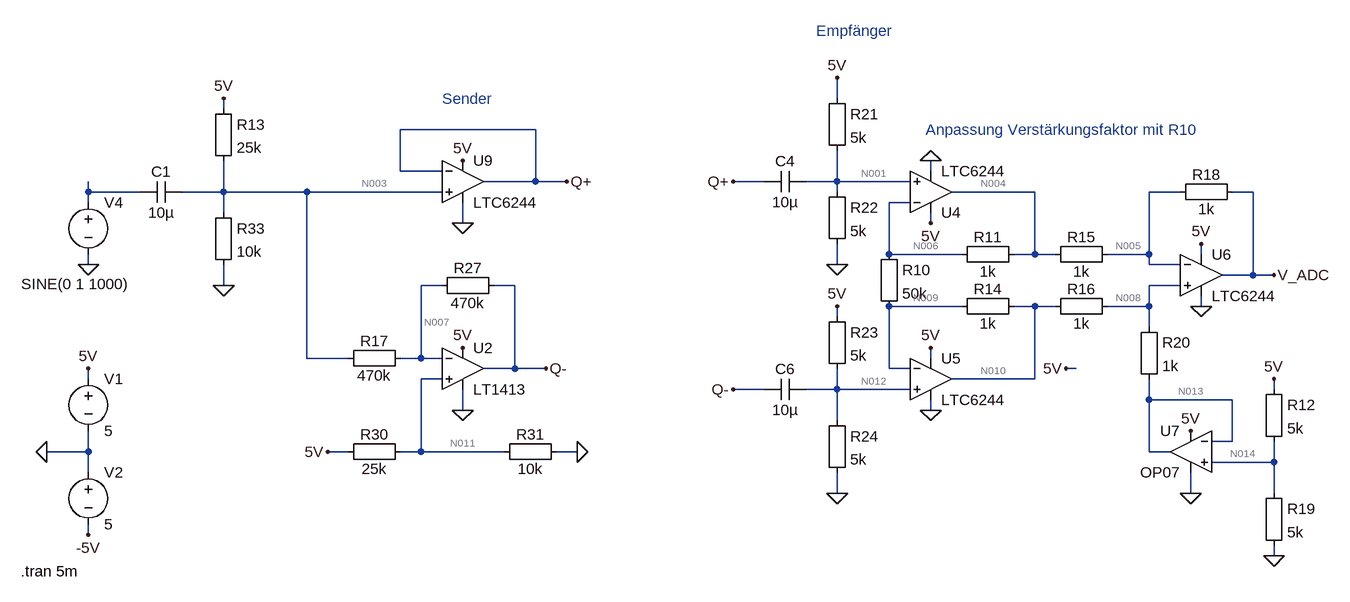
[diagram p0: schematic Schaltung und Anpassung.asc]
Schaltung und Anpassung.asc, the LTspice schematic file:
Version 4
SHEET 1 2416 1684
WIRE 1552 -80 1552 -112
WIRE 608 -64 608 -80
WIRE 1088 -32 880 -32
WIRE 880 32 880 -32
WIRE 944 32 880 32
WIRE 1696 32 1696 16
WIRE 1088 48 1088 -32
WIRE 1088 48 1008 48
WIRE 1136 48 1088 48
WIRE 1440 48 1392 48
WIRE 1552 48 1552 0
WIRE 1552 48 1504 48
WIRE 1664 48 1552 48
WIRE 400 64 400 48
WIRE 480 64 400 64
WIRE 608 64 608 16
WIRE 608 64 544 64
WIRE 736 64 608 64
WIRE 944 64 736 64
WIRE 1552 64 1552 48
WIRE 1856 64 1728 64
WIRE 2080 64 2032 64
WIRE 2192 64 2160 64
WIRE 400 80 400 64
WIRE 1664 80 1632 80
WIRE 608 96 608 64
WIRE 976 112 976 80
WIRE 1696 112 1696 96
WIRE 1632 160 1632 80
WIRE 1744 160 1632 160
WIRE 1856 160 1856 64
WIRE 1856 160 1824 160
WIRE 1888 160 1856 160
WIRE 2032 160 2032 64
WIRE 2032 160 1968 160
WIRE 2112 160 2112 144
WIRE 400 176 400 160
WIRE 1552 176 1552 144
WIRE 2032 176 2032 160
WIRE 2080 176 2032 176
WIRE 2192 192 2192 64
WIRE 2192 192 2144 192
WIRE 2224 192 2192 192
WIRE 608 208 608 176
WIRE 944 208 912 208
WIRE 1056 208 1024 208
WIRE 2080 208 2032 208
WIRE 1744 240 1632 240
WIRE 1856 240 1824 240
WIRE 1888 240 1856 240
WIRE 2032 240 2032 208
WIRE 2032 240 1968 240
WIRE 2112 240 2112 224
WIRE 1552 256 1552 240
WIRE 2032 272 2032 240
WIRE 736 320 736 64
WIRE 800 320 736 320
WIRE 912 320 912 208
WIRE 912 320 880 320
WIRE 944 320 912 320
WIRE 1696 320 1696 304
WIRE 1056 336 1056 208
WIRE 1056 336 1008 336
WIRE 1104 336 1056 336
WIRE 1632 336 1632 240
WIRE 1664 336 1632 336
WIRE 1920 336 1904 336
WIRE 400 352 400 336
WIRE 944 352 912 352
WIRE 1856 352 1856 240
WIRE 1856 352 1728 352
WIRE 1440 368 1392 368
WIRE 1552 368 1552 336
WIRE 1552 368 1504 368
WIRE 1664 368 1552 368
WIRE 2224 368 2224 352
WIRE 2032 384 2032 352
WIRE 2160 384 2032 384
WIRE 976 400 976 368
WIRE 1696 400 1696 384
WIRE 1552 416 1552 368
WIRE 2160 448 2160 384
WIRE 2160 448 2128 448
WIRE 400 464 400 432
WIRE 400 464 336 464
WIRE 800 464 768 464
WIRE 912 464 912 352
WIRE 912 464 880 464
WIRE 1040 464 912 464
WIRE 1152 464 1120 464
WIRE 2032 464 2032 384
WIRE 2064 464 2032 464
WIRE 2224 480 2224 448
WIRE 2224 480 2128 480
WIRE 400 496 400 464
WIRE 1552 528 1552 496
WIRE 2096 528 2096 496
WIRE 2224 528 2224 480
WIRE 400 592 400 576
WIRE 2224 624 2224 608
FLAG 1696 112 5V
FLAG 1696 304 5V
FLAG 2112 144 5V
FLAG 1696 16 0
FLAG 1696 400 0
FLAG 2112 240 0
FLAG 1552 176 0
FLAG 1552 528 0
FLAG 1552 -112 5V
FLAG 1552 240 5V
FLAG 1904 336 5V
FLAG 2224 192 V_ADC
FLAG 400 176 0
FLAG 976 16 5V
FLAG 976 304 5V
FLAG 976 112 0
FLAG 976 400 0
FLAG 1152 464 0
FLAG 768 464 5V
FLAG 608 208 0
FLAG 608 -80 5V
FLAG 1136 48 Q+
FLAG 1104 336 Q-
FLAG 1392 48 Q+
FLAG 1392 368 Q-
FLAG 2096 528 0
FLAG 2096 432 5V
FLAG 2224 624 0
FLAG 2224 352 5V
FLAG 336 464 0
FLAG 400 336 5V
FLAG 400 592 -5V
SYMBOL OpAmps\\LTC6244 1696 64 M180
SYMATTR InstName U4
SYMBOL OpAmps\\LTC6244 1696 352 R0
SYMATTR InstName U5
SYMBOL Misc\\EuropeanResistor 1616 144 R0
SYMATTR InstName R10
SYMATTR Value 50k
SYMBOL Misc\\EuropeanResistor 1840 144 R90
WINDOW 0 5 56 VBottom 2
WINDOW 3 27 56 VTop 2
SYMATTR InstName R11
SYMATTR Value 1k
SYMBOL Misc\\EuropeanResistor 1840 224 R90
WINDOW 0 5 56 VBottom 2
WINDOW 3 27 56 VTop 2
SYMATTR InstName R14
SYMATTR Value 1k
SYMBOL Misc\\EuropeanResistor 1984 144 R90
WINDOW 0 5 56 VBottom 2
WINDOW 3 27 56 VTop 2
SYMATTR InstName R15
SYMATTR Value 1k
SYMBOL Misc\\EuropeanResistor 1984 224 R90
WINDOW 0 5 56 VBottom 2
WINDOW 3 27 56 VTop 2
SYMATTR InstName R16
SYMATTR Value 1k
SYMBOL OpAmps\\LTC6244 2112 192 R0
SYMATTR InstName U6
SYMBOL Misc\\EuropeanResistor 2176 48 R90
WINDOW 0 5 56 VBottom 2
WINDOW 3 27 56 VTop 2
SYMATTR InstName R18
SYMATTR Value 1k
SYMBOL Misc\\EuropeanCap 1504 32 R90
WINDOW 0 0 32 VBottom 2
WINDOW 3 32 32 VTop 2
SYMATTR InstName C4
SYMATTR Value 10µ
SYMBOL Misc\\EuropeanCap 1504 352 R90
WINDOW 0 0 32 VBottom 2
WINDOW 3 32 32 VTop 2
SYMATTR InstName C6
SYMATTR Value 10µ
SYMBOL Misc\\EuropeanResistor 1536 -96 R0
SYMATTR InstName R21
SYMATTR Value 5k
SYMBOL Misc\\EuropeanResistor 1536 48 R0
SYMATTR InstName R22
SYMATTR Value 5k
SYMBOL Misc\\EuropeanResistor 1536 240 R0
SYMATTR InstName R23
SYMATTR Value 5k
SYMBOL Misc\\EuropeanResistor 1536 400 R0
SYMATTR InstName R24
SYMATTR Value 5k
SYMBOL voltage 400 64 R0
WINDOW 3 -103 142 Left 2
WINDOW 123 0 0 Left 0
WINDOW 39 0 0 Left 0
SYMATTR Value SINE(0 1 1000)
SYMATTR InstName V4
SYMBOL Misc\\EuropeanResistor 896 304 R90
WINDOW 0 5 56 VBottom 2
WINDOW 3 27 56 VTop 2
SYMATTR InstName R17
SYMATTR Value 470k
SYMBOL Misc\\EuropeanResistor 1040 192 R90
WINDOW 0 5 56 VBottom 2
WINDOW 3 27 56 VTop 2
SYMATTR InstName R27
SYMATTR Value 470k
SYMBOL Misc\\EuropeanResistor 896 448 R90
WINDOW 0 5 56 VBottom 2
WINDOW 3 27 56 VTop 2
SYMATTR InstName R30
SYMATTR Value 25k
SYMBOL Misc\\EuropeanResistor 1136 448 R90
WINDOW 0 5 56 VBottom 2
WINDOW 3 27 56 VTop 2
SYMATTR InstName R31
SYMATTR Value 10k
SYMBOL OpAmps\\LT1413 976 272 R0
SYMATTR InstName U2
SYMBOL OpAmps\\LTC6244 976 48 R0
SYMATTR InstName U9
SYMBOL cap 544 48 R90
WINDOW 0 0 32 VBottom 2
WINDOW 3 32 32 VTop 2
SYMATTR InstName C1
SYMATTR Value 10µ
SYMBOL Misc\\EuropeanResistor 592 -80 R0
SYMATTR InstName R13
SYMATTR Value 25k
SYMBOL Misc\\EuropeanResistor 592 80 R0
SYMATTR InstName R33
SYMATTR Value 10k
SYMBOL OpAmps\\OP07 2096 400 M0
SYMATTR InstName U7
SYMBOL Misc\\EuropeanResistor 2208 352 R0
SYMATTR InstName R12
SYMATTR Value 5k
SYMBOL Misc\\EuropeanResistor 2208 512 R0
SYMATTR InstName R19
SYMATTR Value 5k
SYMBOL Misc\\EuropeanResistor 2016 256 R0
SYMATTR InstName R20
SYMATTR Value 1k
SYMBOL voltage 400 336 R0
WINDOW 123 0 0 Left 0
WINDOW 39 0 0 Left 0
SYMATTR InstName V1
SYMATTR Value 5
SYMBOL voltage 400 480 R0
WINDOW 123 0 0 Left 0
WINDOW 39 0 0 Left 0
SYMATTR InstName V2
SYMATTR Value 5
TEXT 1520 -184 Left 2 ;Empfänger
TEXT 1688 -32 Left 2 ;Anpassung Verstärkungsfaktor mit R10
TEXT 944 -80 Left 2 ;Sender
TEXT 296 648 Left 2 !.tran 5m

The netlist it stands for:
* Schaltung und Anpassung.asc
XU4 N001 N006 5V 0 N004 LTC6244  ; pins In+ In- V+ V- OUT
XU5 N012 N009 5V 0 N010 LTC6244  ; pins In+ In- V+ V- OUT
R10 N006 N009 50k
R11 N004 N006 1k
R14 N010 N009 1k
R15 N005 N004 1k
R16 N008 N010 1k
XU6 N008 N005 5V 0 V_ADC LTC6244  ; pins In+ In- V+ V- OUT
R18 V_ADC N005 1k
C4 N001 Q+ 10µ
C6 N012 Q- 10µ
R21 5V N001 5k
R22 N001 0 5k
R23 5V N012 5k
R24 N012 0 5k
V4 N002 0 SINE(0 1 1000)
R17 N007 N003 470k
R27 Q- N007 470k
R30 N011 5V 25k
R31 0 N011 10k
XU2 N011 N007 5V 0 Q- LT1413  ; pins In+ In- V+ V- OUT
XU9 N003 Q+ 5V 0 Q+ LTC6244  ; pins In+ In- V+ V- OUT
C1 N003 N002 10µ
R13 5V N003 25k
R33 N003 0 10k
XU7 N014 N013 5V 0 N013 LT1001  ; OP07, pins In+ In- V+ V- OUT
R12 5V N014 5k
R19 N014 0 5k
R20 N008 N013 1k
V1 5V 0 5
V2 0 -5V 5
* Empfänger
* Anpassung Verstärkungsfaktor mit R10
* Sender
.tran 5m
.lib LTC.lib
.backanno
.end

* Results of the author's LTspice run, read from the files saved beside the schematic
* Operating Point, zero values left out:
*   V(n006) = 2.5 V
*   V(n001) = 2.5 V
*   V(5v) = 5 V
*   V(n004) = 2.5 V
*   V(n009) = 2.5 V
*   V(n012) = 2.5 V
*   V(n010) = 2.5 V
*   V(n005) = 2.5 V
*   V(n008) = 2.5 V
*   V(v_adc) = 2.5 V
*   V(q+) = 1.429 V
*   V(q-) = 1.423 V
*   V(n007) = 1.429 V
*   V(n003) = 1.429 V
*   V(n011) = 1.429 V
*   V(n013) = 2.5 V
*   V(n014) = 2.5 V
*   V(-5v) = -5 V
*   I(R15) = -11.46 pA
*   I(R16) = -5.206 pA
*   I(R18) = -11.46 pA
*   I(R21) = 500 µA
*   I(R22) = 500 µA
*   I(R23) = 500 µA
*   I(R24) = 500 µA
*   I(R17) = 182.7 pA
*   I(R27) = -11.93 nA
*   I(R30) = -142.9 µA
*   I(R31) = -142.9 µA
*   I(R13) = 142.9 µA
*   I(R33) = 142.9 µA
*   I(R12) = 500 µA
*   I(R19) = 500 µA
*   I(R20) = 5.206 pA
*   I(V1) = -27.54 mA
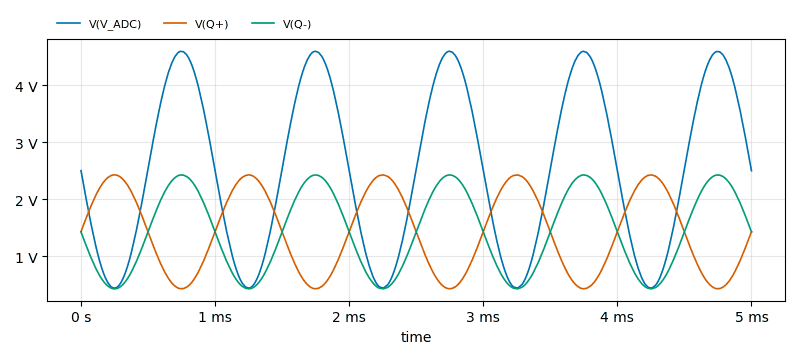
[diagram p1: Transient Analysis of Schaltung und Anpassung.asc, plotted from the saved traces]
* Transient Analysis, 1 run:
*   V(V_ADC): min 437.2 mV, max 4.596 V, average 2.516 V, rms 2.915 V, last 2.499 V
*   V(Q+): min 426.5 mV, max 2.426 V, average 1.426 V, rms 1.592 V, last 1.429 V
*   V(Q-): min 425.5 mV, max 2.425 V, average 1.425 V, rms 1.591 V, last 1.425 V